# EAGLE design WM-control_module_Rev1 (EAGLE 7.7.0)
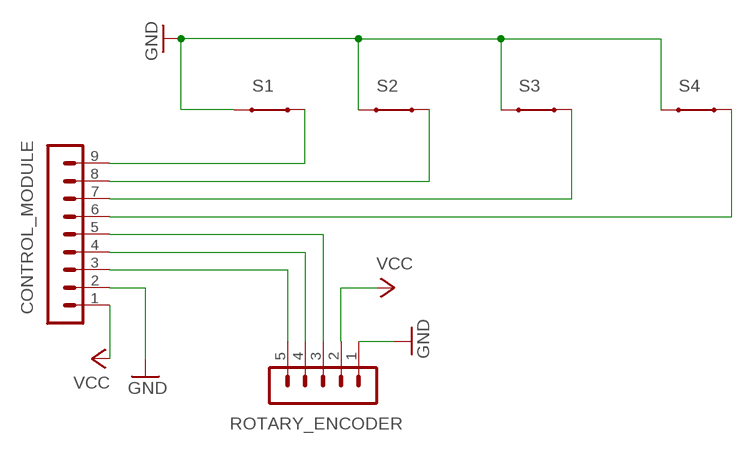
[diagram p0: schematic, sheet 1]

## Parts
CONTROL_MODULE  MA09-1  [MA09-1]
ROTARY_ENCODER  MA05-1  [MA05-1]
S1  SWITCH-MOMENTARY-2-CLOSED  [TACTILE-PTH-12MM]
S2  SWITCH-MOMENTARY-2-CLOSED  [TACTILE-PTH-12MM]
S3  SWITCH-MOMENTARY-2-CLOSED  [TACTILE-PTH-12MM]
S4  SWITCH-MOMENTARY-2-CLOSED  [TACTILE-PTH-12MM]

## Nets
GND: CONTROL_MODULE.2 ROTARY_ENCODER.1 S1.1 S2.1 S3.1 S4.1
N$1: CONTROL_MODULE.3 ROTARY_ENCODER.5
N$2: CONTROL_MODULE.4 ROTARY_ENCODER.4
N$3: CONTROL_MODULE.5 ROTARY_ENCODER.3
N$4: CONTROL_MODULE.9 S1.3
N$5: CONTROL_MODULE.8 S2.3
N$6: CONTROL_MODULE.7 S3.3
N$7: CONTROL_MODULE.6 S4.3
VCC: CONTROL_MODULE.1 ROTARY_ENCODER.2

## Library data of the parts
CONTROL_MODULE = con-lstb:MA09-1: PIN HEADER; OC_FARNELL: unknown; OC_NEWARK: unknown
ROTARY_ENCODER = con-lstb:MA05-1: PIN HEADER; OC_FARNELL: unknown; OC_NEWARK: unknown
S1-S4 = SparkFun-Electromechanical:SWITCH-MOMENTARY-2-CLOSED: Closed Switch for tutorial schematics. Not intended for PCB design. Maps to 12mm tact switch, only because eagle won't place a part with no package defined. The ordinary SWITCH-MOMENTARY-2 is likely to be more useful for regular schematics.

## Net classes
0 default: width 0.508 mm, clearance 0.508 mm

## Board
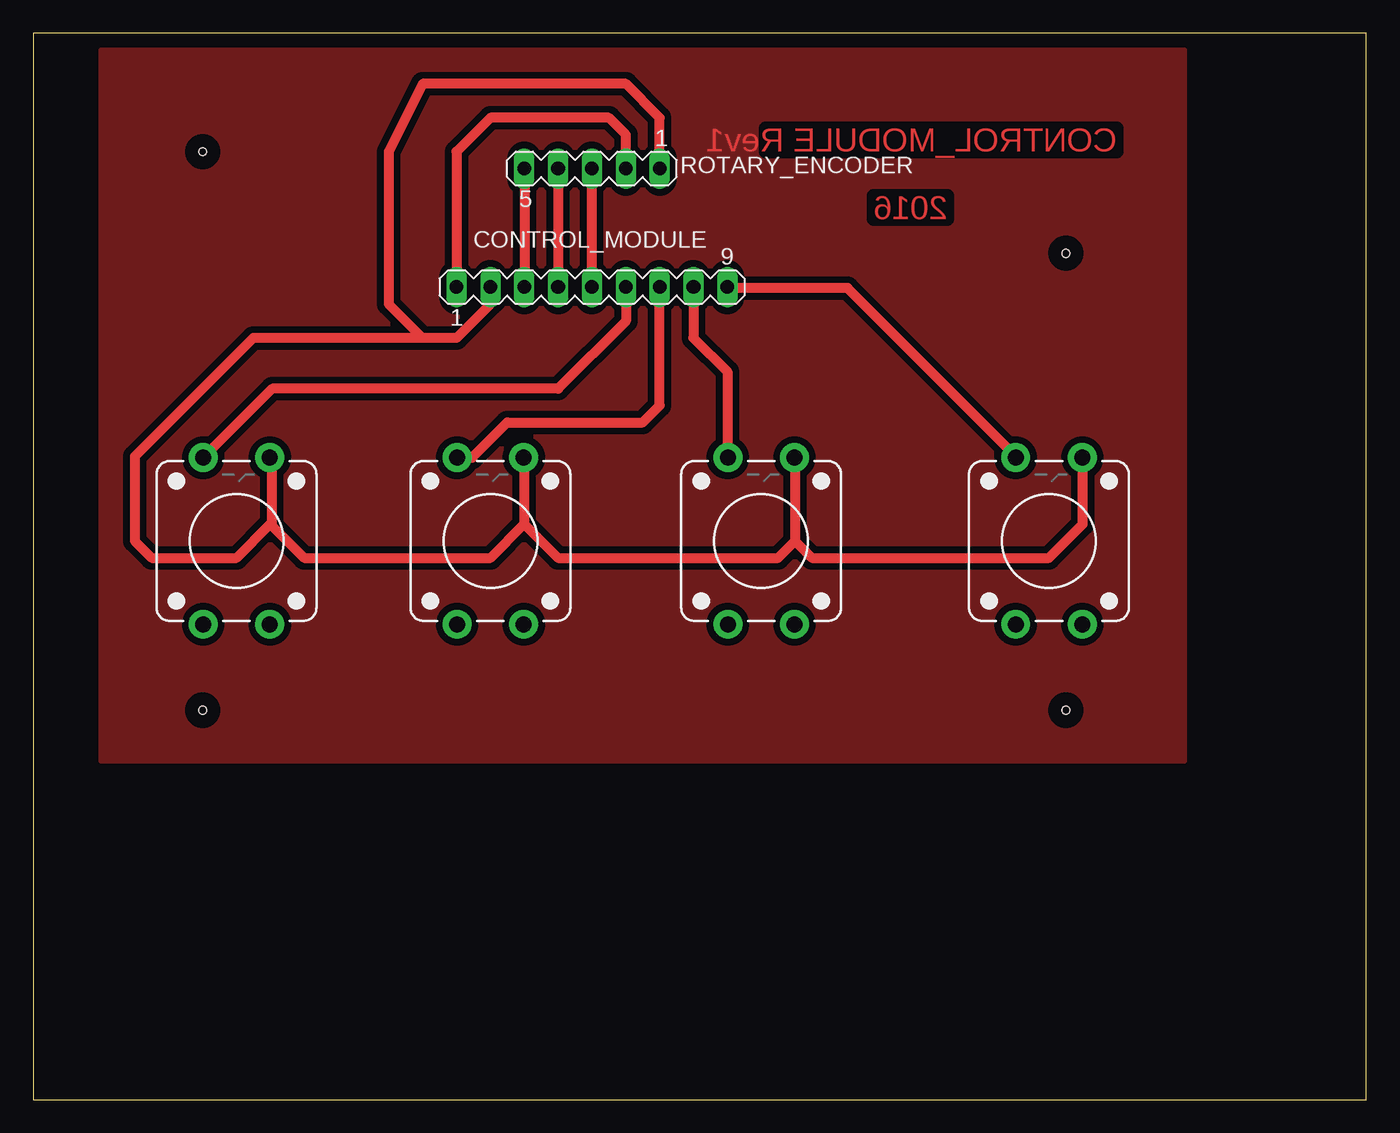
[diagram p1: board, top side]

Size 100 x 80 mm. Coordinates in mm from the lower left corner, seen from the top.
Outline: 0,0 100,0 100,80 0,80 0,0
Copper layers (1*16): Top 0.035mm / dielectric 1.5mm / Bottom 0.035mm
Design rules "default": minimum track width 10mil, minimum drill 24mil, track to track 8mil, track to pad 8mil, pad to pad 8mil, via to via 8mil, smd to smd 8mil, copper to edge 40mil, drill to drill 8mil, minimum pad ring 10mil, minimum via ring 8mil, stop-mask expansion 4mil, vias tented up to drill 0mil, thermal gap 10mil
Holes 0.6 mm at 12.7,71.12 12.7,29.21 77.47,29.21 77.47,63.5

### Footprints (pad centres in the part's own frame; a part is rotated, then mirrored left to right if it is on the bottom)
MA09-1 = drill 1.016 long: 1 -10.16,0; 2 -7.62,0; 3 -5.08,0; 4 -2.54,0; 5 0,0; 6 2.54,0; 7 5.08,0; 8 7.62,0; 9 10.16,0
MA05-1 = drill 1.016 long: 1 -5.08,0; 2 -2.54,0; 3 0,0; 4 2.54,0; 5 5.08,0
TACTILE-PTH-12MM = drill 1.2 pad 2.159: 1 6.25,-2.5; 2 -6.25,-2.5; 3 6.25,2.5; 4 -6.25,2.5

### Placement (x,y rotation side)
CONTROL_MODULE  41.91,60.96 0 top
ROTARY_ENCODER  41.91,69.85 180 top
S1  76.2,41.91 90 top
S2  54.61,41.91 90 top
S3  34.29,41.91 90 top
S4  15.24,41.91 90 top

### Tracks (layer width: path | path; a pad name or v marks a point on that pad's centre or on a via)
GND  (via drill 0.6)
  Top 0.254: 17.88,48.08 S4.1
  Top 0.406: 17.78,43.18 17.78,48.12 S4.1 | 36.83,48.12 S3.1 | v57.15,48.12 S2.1 | 78.74,48.12 S1.1
  Top 0.762: ROTARY_ENCODER.1 46.99,73.66 44.45,76.2 29.21,76.2 26.67,71.12 26.67,59.69 29.21,57.15 | CONTROL_MODULE.2 34.29,59.69 31.75,57.15 29.21,57.15 | 29.21,57.15 16.51,57.15 7.62,48.26 7.62,41.91 8.89,40.64 15.24,40.64 17.78,43.18 | 17.88,48.08 17.88,43.08 20.32,40.64 34.29,40.64 36.83,43.18 | 36.83,48.12 36.83,43.18 | 36.83,43.18 39.37,40.64 55.88,40.64 57.15,41.91 | v57.15,48.12 57.15,41.91 | 57.15,41.91 58.42,40.64 76.2,40.64 78.74,43.18 78.74,48.12
N$1
  Top 0.254: 36.85,61.11 CONTROL_MODULE.3 | 36.85,69.8 ROTARY_ENCODER.5
  Top 0.762: 36.85,69.8 36.85,61.11
N$2
  Top 0.762: ROTARY_ENCODER.4 CONTROL_MODULE.4
N$3
  Top 0.254: 41.88,61.11 CONTROL_MODULE.5 | 41.88,69.8 ROTARY_ENCODER.3
  Top 0.762: 41.88,69.8 41.88,61.11
N$4
  Top 0.254: 52.17,60.88 CONTROL_MODULE.9 | 73.66,48.31 S1.3
  Top 0.762: 52.17,60.88 61.09,60.88 73.66,48.31
N$5  (via drill 0.6)
  Top 0.406: v52.07,48.2 S2.3
  Top 0.762: CONTROL_MODULE.8 49.53,57.15 52.07,54.61 v52.07,48.2
N$6
  Top 0.762: S3.3 32.92,48.16 35.56,50.8 45.72,50.8 46.99,52.07 CONTROL_MODULE.7
N$7
  Top 0.762: CONTROL_MODULE.6 44.45,58.42 39.37,53.34 17.92,53.34 S4.3
N$8
  pour Top: 5.08,78.74 5.08,25.4 86.36,25.4 86.36,78.74
VCC
  Top 0.762: ROTARY_ENCODER.2 44.45,72.39 43.18,73.66 34.29,73.66 31.75,71.12 CONTROL_MODULE.1

### Text on the board
Top: CONTROL_MODULE Rev1 | 2016